# EAGLE schematic led_master (EAGLE 6.1)
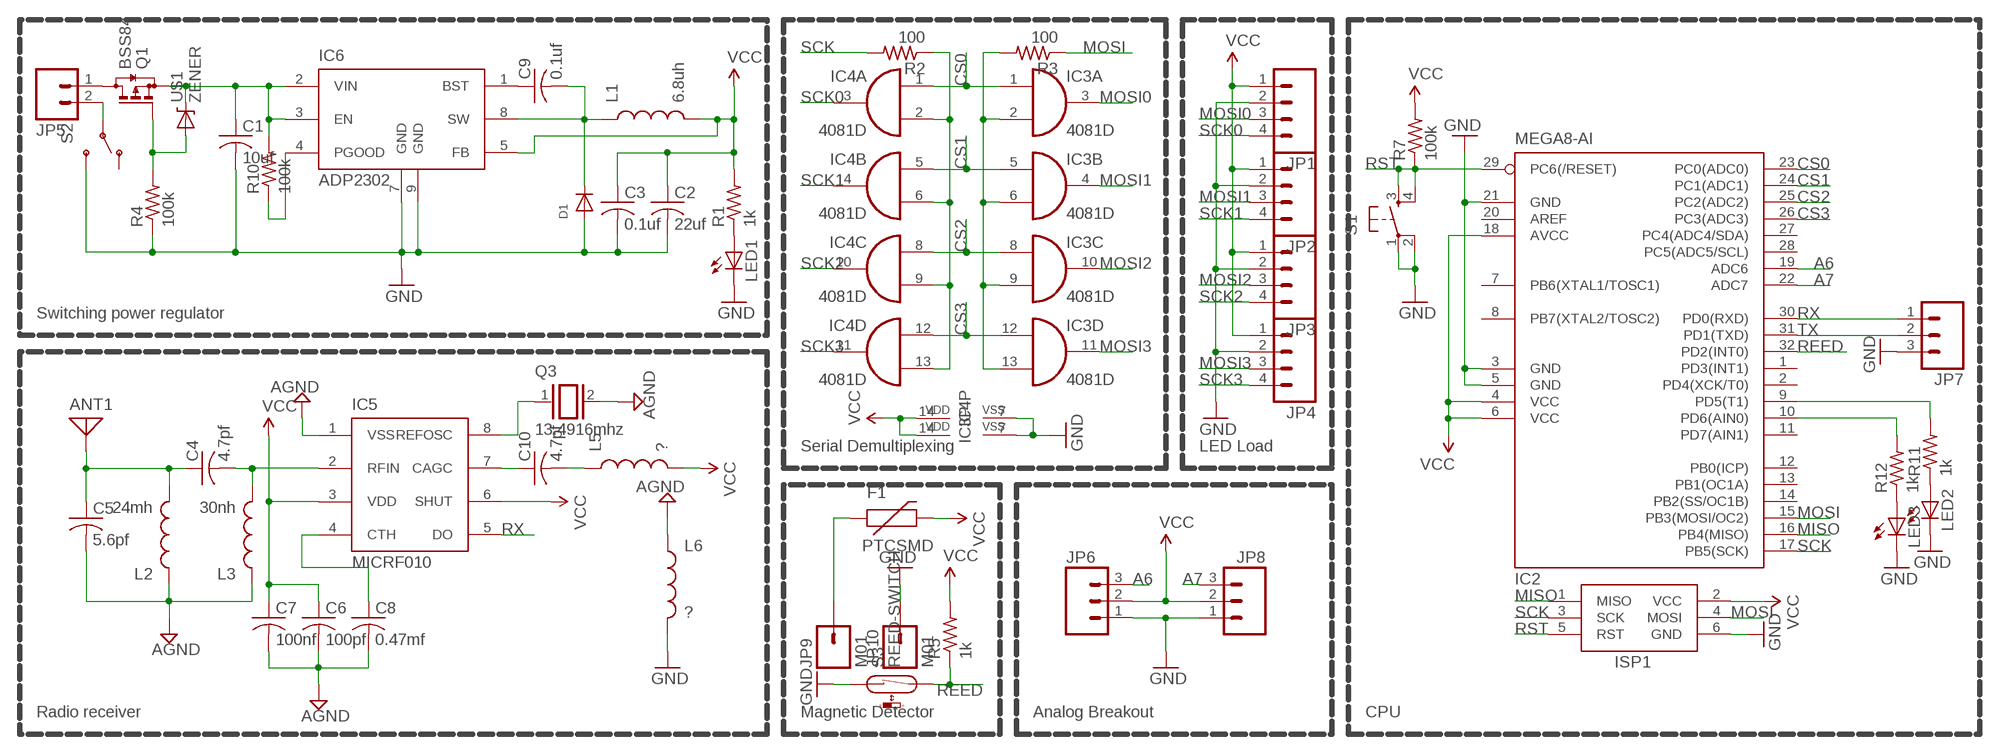
[diagram p0: schematic, sheet 1]

## Parts
ANT1  ANTENNA  [PAD-01]
C1  10uf  C-USC1206  [C1206]
C2  22uf  C-USC1206  [C1206]
C3  0.1uf  C-USC1206  [C1206]
C4  4.7pf  C-USC1206  [C1206]
C5  5.6pf  C-USC1206  [C1206]
C6  100pf  C-USC1206  [C1206]
C7  100nf  C-USC1206  [C1206]
C8  0.47mf  C-USC1206  [C1206]
C9  0.1uf  C-USC1206  [C1206]
C10  4.7pf  C-USC1206  [C1206]
D1  DIODESOD-123  [SOD-123]
F1  PTCSMD  [PTC-1206]
IC2  MEGA8-AI  [TQFP32-08]
IC3  4081D  [SO14]
IC4  4081D  [SO14]
IC5  MICRF010  [SOIC8]
IC6  ADP2302  [SOIC8-PAD]
ISP1  AVRISP-6  [AVRISP]
JP1  M04LONGPADS  [1X04_LONGPADS]
JP2  M04LONGPADS  [1X04_LONGPADS]
JP3  M04LONGPADS  [1X04_LONGPADS]
JP4  M04LONGPADS  [1X04_LONGPADS]
JP5  M02-JST-2MM-SMT  [JST-2-SMD]
JP6  M03PTH  [1X03]
JP7  M03PTH  [1X03]
JP8  M03PTH  [1X03]
JP9  M01  M01-SMTSO-256-ET  [SMTSO-256-ET]
JP10  M01  M01-SMTSO-256-ET  [SMTSO-256-ET]
L1  6.8uh  INDUCTOR1210  [1210]
L2  24mh  INDUCTOR1210  [1210]
L3  30nh  INDUCTOR1210  [1210]
L5  ?  INDUCTOR1210  [1210]
L6  ?  INDUCTOR1210  [1210]
LED1  LEDSMT1206  [1206]
LED2  LEDSMT1206  [1206]
LED3  LEDSMT1206  [1206]
Q1  BSS84  [SOT23]
Q3  13.4916mhz  XTAL/S  [QS]
R1  1k  R-US_R1206  [R1206]
R2  100  R-US_R1206  [R1206]
R3  100  R-US_R1206  [R1206]
R4  100k  R-US_R1206  [R1206]
R5  1k  R-US_R1206  [R1206]
R7  100k  R-US_R1206  [R1206]
R10  100k  R-US_R1206  [R1206]
R11  1k  R-US_R1206  [R1206]
R12  1k  R-US_R1206  [R1206]
S1  TAC_SWITCHSMD  [TACTILE_SWITCH_SMD]
S2  SWITCH-SPSTSMD2  [SWITCH-SPDT-SMD]
S3  REED-SWITCH  REED-SWITCH-CT10-1530-G1  [CT10-G1]
U$1  ZENER  DIODE-ZENER-BZT52  [SOD-323]

## Nets
A6: IC2.19(ADC6) JP6.3
A7: IC2.22(ADC7) JP8.3
AGND: C5.2 C6.2 C7.2 C8.2 IC5.1(VSS) L2.1 L3.1 L6.1 Q3.2
ANT: ANT1.1 C4.1 C5.1 L2.2
CS0: IC2.23(PC0(ADC0)) IC3.1(A:I0) IC4.1(A:I0)
CS1: IC2.24(PC1(ADC1)) IC3.5(B:I0) IC4.5(B:I0)
CS2: IC2.25(PC2(ADC2)) IC3.8(C:I0) IC4.8(C:I0)
CS3: IC2.26(PC3(ADC3)) IC3.12(D:I0) IC4.12(D:I0)
GND: C1.2 C2.2 C3.2 D1.A IC2.3(GND) IC2.5(GND) IC2.21(GND) IC3.7(P:VSS) IC4.7(P:VSS) IC6.7(GND) IC6.9(GND) ISP1.6(GND) JP1.2 JP2.2 JP3.2 JP4.2 JP6.1 JP7.3 JP8.1 JP10.P$1 L6.2 LED1.C LED2.C LED3.C R4.1 S1.1 S1.2 S2.3(S) S3.1
MISO: IC2.16(PB4(MISO)) ISP1.1(MISO)
MOSI: IC2.15(PB3(MOSI/OC2)) ISP1.4(MOSI) R3.1
MOSI0: IC3.3(A:O) JP1.3
MOSI1: IC3.4(B:O) JP2.3
MOSI2: IC3.10(C:O) JP3.3
MOSI3: IC3.11(D:O) JP4.3
N$1: IC4.2(A:I1) IC4.6(B:I1) IC4.9(C:I1) IC4.13(D:I1) R2.1
N$2: LED2.A R11.1
N$3: JP5.2 S2.2(P)
N$4: IC3.2(A:I1) IC3.6(B:I1) IC3.9(C:I1) IC3.13(D:I1) R3.2
N$5: LED3.A R12.1
N$6: Q1.1(G) R4.2 U$1.2(A)
N$7: JP5.1 Q1.3(D)
N$8: C1.1 IC6.2(VIN) IC6.3(EN) Q1.2(S) R10.2 U$1.1(C)
N$9: IC5.8(REFOSC) Q3.1
N$10: LED1.A R1.1
N$11: C10.1 IC5.7(CAGC)
N$12: C10.2 L5.1
N$13: C4.2 IC5.2(RFIN) L3.2
N$14: C8.1 IC5.4(CTH)
N$15: F1.1 JP9.P$1
N$17: IC6.4(PGOOD) R10.1
N$18: IC2.10(PD6(AIN0)) R12.2
N$19: C9.2 D1.C IC6.8(SW) L1.1
N$20: C9.1 IC6.1(BST)
N$21: IC2.9(PD5(T1)) R11.2
REED: IC2.32(PD2(INT0)) R5.1 S3.2
RST: IC2.29(PC6(/RESET)) ISP1.5(RST) R7.1 S1.3 S1.4
RX: IC2.30(PD0(RXD)) IC5.5(DO) JP7.1
SCK: IC2.17(PB5(SCK)) ISP1.3(SCK) R2.2
SCK0: IC4.3(A:O) JP1.4
SCK1: IC4.4(B:O) JP2.4
SCK2: IC4.10(C:O) JP3.4
SCK3: IC4.11(D:O) JP4.4
TX: IC2.31(PD1(TXD)) JP7.2
VCC: C2.1 C3.1 C6.1 C7.1 F1.2 IC2.4(VCC) IC2.6(VCC) IC2.18(AVCC) IC3.14(P:VDD) IC4.14(P:VDD) IC5.3(VDD) IC5.6(SHUT) IC6.5(FB) ISP1.2(VCC) JP1.1 JP2.1 JP3.1 JP4.1 JP6.2 JP8.2 L1.2 L5.2 R1.2 R5.2 R7.2
Unconnected: IC2.1(PD3(INT1)) IC2.2(PD4(XCK/T0)) IC2.7(PB6(XTAL1/TOSC1)) IC2.8(PB7(XTAL2/TOSC2)) IC2.11(PD7(AIN1)) IC2.12(PB0(ICP)) IC2.13(PB1(OC1A)) IC2.14(PB2(SS/OC1B)) IC2.20(AREF) IC2.27(PC4(ADC4/SDA)) IC2.28(PC5(ADC5/SCL)) S2.1(O)

## Notes on the sheet
- Switching power regulator
- Serial Demultiplexing | LED Load
- Radio receiver | Magnetic Detector | Analog Breakout | CPU

## Library data of the parts
ANT1 = discrete:ANTENNA: Antenna
C1-C10 = adafruit:C-US: CAPACITOR, American symbol
D1 = adafruit:DIODE: Diode SMADIODE - SMA Surface Mount Package 20V 1A Schottky Diode Digikey: 641-1014-6-ND DO-1N4148 - Through Hole Small Current Diode SOD-123 20V 1 A (.5mV Vf) Schottky Diode - Digikey: MBRX120TPMSCT-ND SOD-323 10V 570mA (.38mV Vf, 3ns) Schottky Diode - Digikey: ZLLS410CT-ND SOD-523 30V 30mA Schottky Diode (RB751S-40TE61) - Digikey: RB751S-40TE61CT-ND SOT23-R/W - SOT23 Package (R = Solder Paste/Reflow Ovens, W = Hand-Soldering) BAT54Film 40V 300mA - Digikey: 497-7162-1-ND
F1 = sparkfun:PTC: Resettable Fuse PTC Resettable Fuse. Spark Fun Electronics SKU : COM-08357
IC2 = atmel:MEGA8: MICROCONTROLLER 8 Kbytes FLASH, 1 kbytes SRAM, 512 bytes EEPROM, USART, 6-channel 10 bit ADC, 2-channel 8 bit ADC Pin compatible with Atmega48, ATMega88, ATMega168 Source: avr.lbr; MPN: ATMEGA8-16AU; OC_FARNELL: 9171371; OC_NEWARK: 73M8863
IC3 IC4 = 40xx:4081: Quad 2-input AND
IC5 = micrel:MICRF010
IC6 = analog-devices:ADP2302
ISP1 = adafruit:AVRISP: AVR ISP HEADER Standard 6 pin header for AVR programming
JP1-JP4 = sparkfun:M04: Header 4 Standard 4-pin 0.1" header. Use with straight break away headers (SKU : PRT-00116), right angle break away headers (PRT-00553), swiss pins (PRT-00743), machine pins (PRT-00117), and female headers (PRT-00115). Molex polarized connector foot print use with SKU : PRT-08231 with associated crimp pins and housings. 1MM SMD Version SKU: PRT-10208
JP5 = sparkfun:M02: Header 2 Standard 2-pin 0.1" header. Use with straight break away headers (SKU : PRT-00116), right angle break away headers (PRT-00553), swiss pins (PRT-00743), machine pins (PRT-00117), and female headers (PRT-00115). Molex polarized connector foot print use with SKU : PRT-08233 with associated crimp pins and housings.
JP6-JP8 = sparkfun:M03: Header 3 Standard 3-pin 0.1" header. Use with straight break away headers (SKU : PRT-00116), right angle break away headers (PRT-00553), swiss pins (PRT-00743), machine pins (PRT-00117), and female headers (PRT-00115). Molex polarized connector foot print use with SKU : PRT-08232 with associated crimp pins and housings.
JP9 JP10 = sparkfun:M01: Header 1 Standard 1-pin 0.1" header. Use with straight break away headers (SKU : PRT-00116), right angle break away headers (PRT-00553), swiss pins (PRT-00743), machine pins (PRT-00117), and female headers (PRT-00115).
L1-L3 L5 L6 = sparkfun:INDUCTOR: Inductors Basic Inductor/Choke - 0603 and 1206. Footprints are not proven and vary greatly between part numbers.
LED1-LED3 = led:LED: LED OSRAM: - CHIPLED LG R971, LG N971, LY N971, LG Q971, LY Q971, LO R971, LY R971 LH N974, LH R974 LS Q976, LO Q976, LY Q976 LO Q996 - Hyper CHIPLED LW Q18S LB Q993, LB Q99A, LB R99A - SideLED LS A670, LO A670, LY A670, LG A670, LP A670 LB A673, LV A673, LT A673, LW A673 LH A674 LY A675 LS A676, LA A676, LO A676, LY A676, LW A676 LS A679, LY A679, LG A679 - Hyper Micro SIDELED® LS Y876, LA Y876, LO Y876, LY Y876 LT Y87S - SmartLED LW L88C, LW L88S LB L89C, LB L89S, LG L890 LS L89K, LO L89K, LY L89K LS L896, LA L896, LO L896, LY L896 - TOPLED LS T670, LO T670, LY T670, LG T670, LP T670 LSG T670, LSP T670, LSY T670, LOP T670, LYG T670 LG T671, LOG T671, LSG T671 LB T673, LV T673, LT T673, LW T673 LH T674 LS T676, LA T676, LO T676, LY T676, LB T676, LH T676, LSB T676, LW T676 LB T67C, LV T67C, LT T67C, LS T67K, LO T67K, LY T67K, LW E67C LS E67B, LA E67B, LO E67B, LY E67B, LB E67C, LV E67C, LT E67C LW T67C LS T679, LY T679, LG T679 LS T770, LO T770, LY T770, LG T770, LP T770 LB T773, LV T773, LT T773, LW T773 LH T774 LS E675, LA E675, LY E675, LS T675 LS T776, LA T776, LO T776, LY T776, LB T776 LHGB T686 LT T68C, LB T68C - Hyper Mini TOPLED® LB M676 - Mini TOPLED Santana® LG M470 LS M47K, LO M47K, LY M47K Source: http://www.osram.convergy.de LUXEON: - LUMILED® LXK2-PW12-R00, LXK2-PW12-S00, LXK2-PW14-U00, LXK2-PW14-V00 LXK2-PM12-R00, LXK2-PM12-S00, LXK2-PM14-U00 LXK2-PE12-Q00, LXK2-PE12-R00, LXK2-PE12-S00, LXK2-PE14-T00, LXK2-PE14-U00 LXK2-PB12-K00, LXK2-PB12-L00, LXK2-PB12-M00, LXK2-PB14-N00, LXK2-PB14-P00, LXK2-PB14-Q00 LXK2-PR12-L00, LXK2-PR12-M00, LXK2-PR14-Q00, LXK2-PR14-R00 LXK2-PD12-Q00, LXK2-PD12-R00, LXK2-PD12-S00 LXK2-PH12-R00, LXK2-PH12-S00 LXK2-PL12-P00, LXK2-PL12-Q00, LXK2-PL12-R00 Source: www.luxeon.com KINGBRIGHT: KA-3528ASYC Source: www.kingbright.com
Q1 = transistor-small-signal:BSS84: P-CHANNEL MOS FET
Q3 = special:XTAL/S: CRYSTAL
R1-R5 R7 R10-R12 = adafruit:R-US_: RESISTOR, American symbol
S1 = sparkfun:TAC_SWITCH: Momentary Switch Button commonly used for reset or general input. Spark Fun Electronics SKU : COM-00097
S2 = sparkfun:SWITCH-SPST: SPST Switch Simple slide switch. Spark Fun Electronics SKU : COM-00102
S3 = switch-reed:REED-SWITCH-: Reed Sensor; MF: COTO TECHNOLOGY; MPN: CT10-1530-G1; OC_FARNELL: 1081696
U$1 = sparkfun:DIODE-ZENER: Zener Diode Production Part - 8199 3.4V Zener Voltage